# EAGLE design Yukari 3 9150 (EAGLE 6.2)
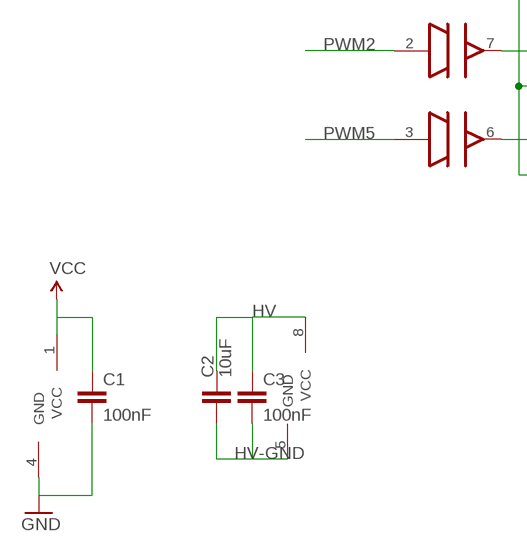
[diagram p0: schematic, sheet 1, part 1 of 2]
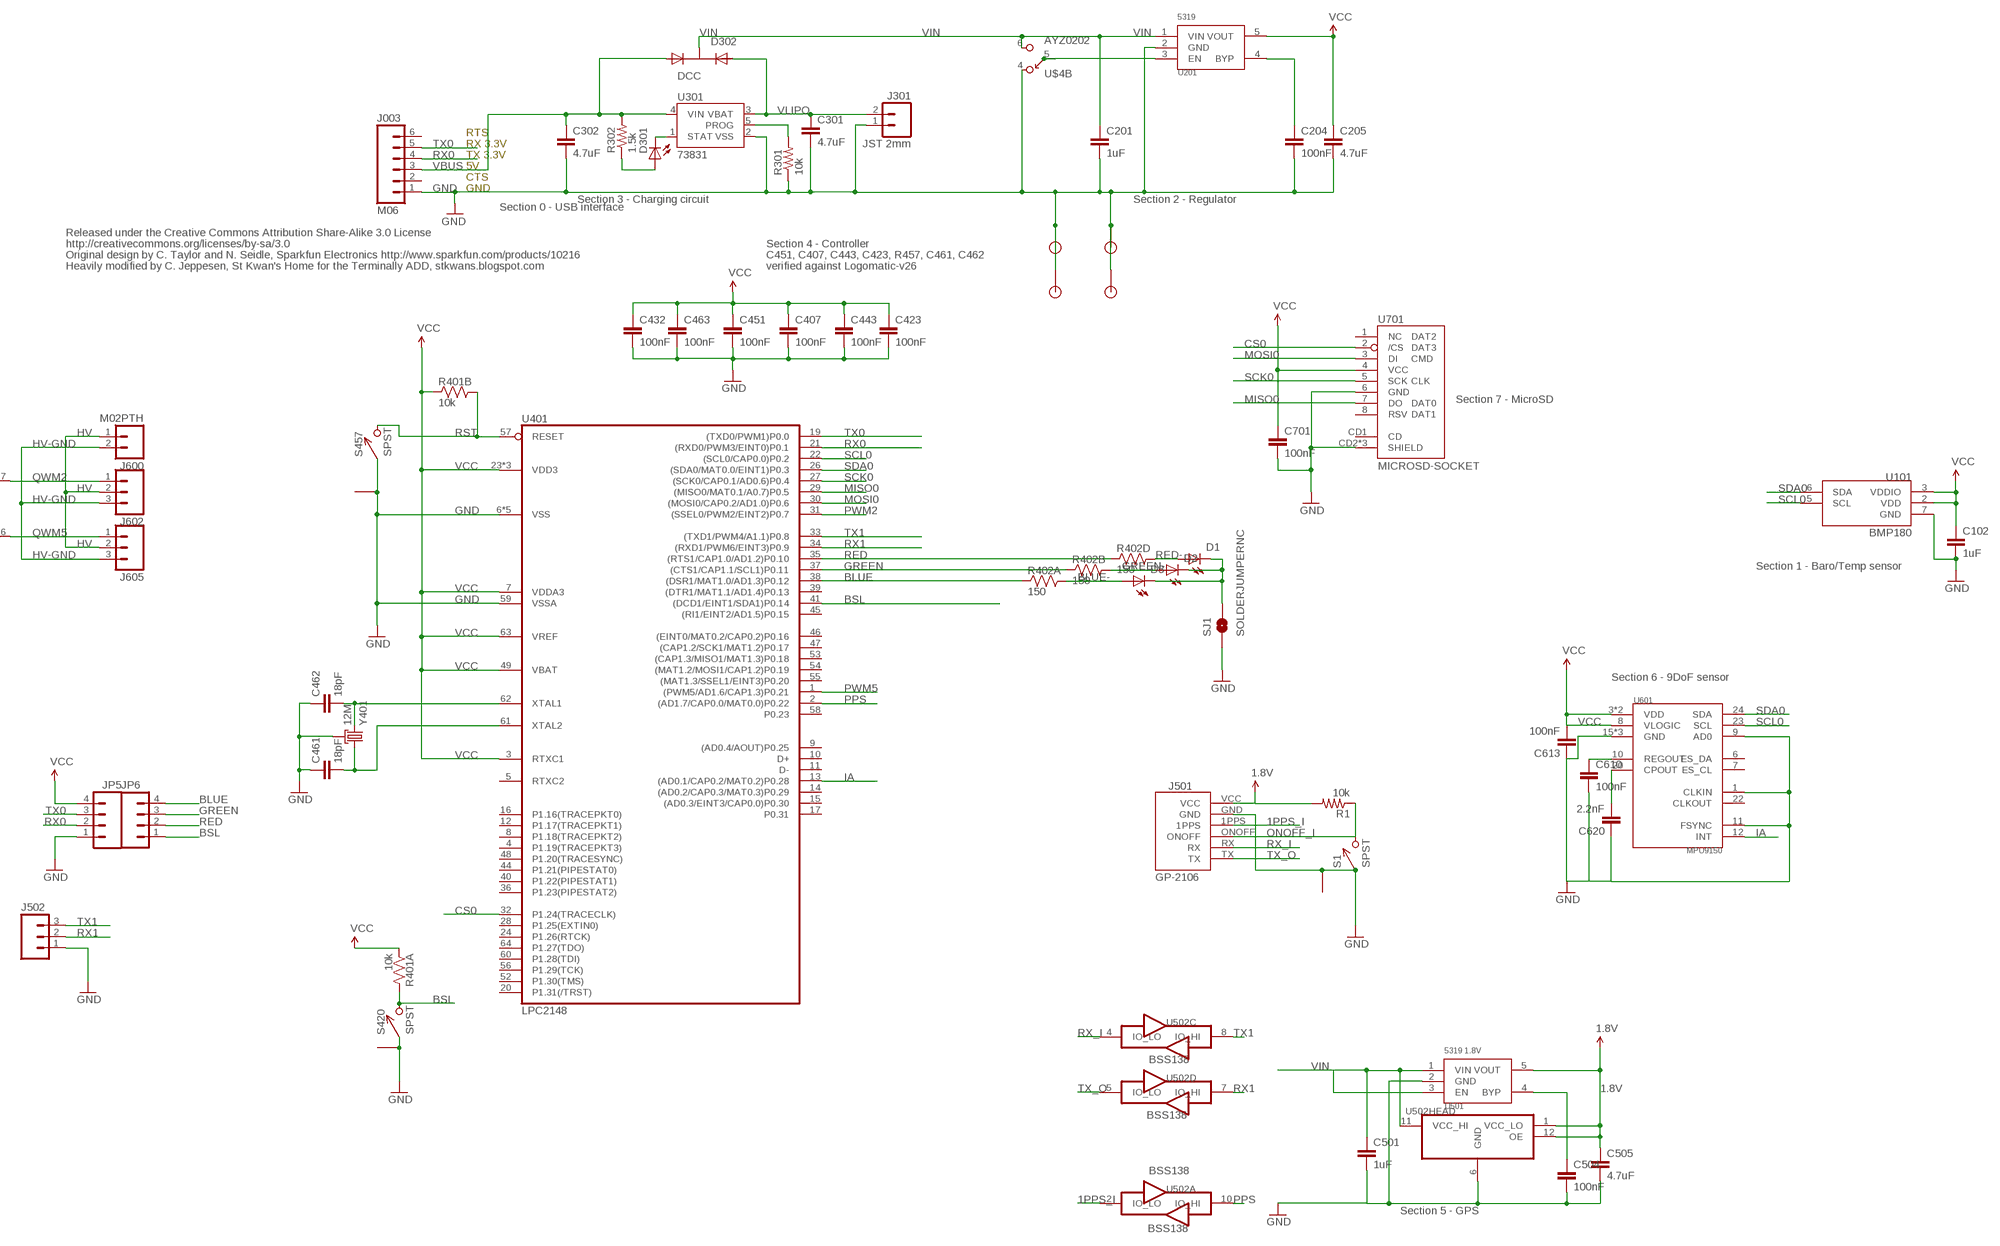
[diagram p1: schematic, sheet 1, part 2 of 2]

## Parts
C1  100nF  CAP0402-CAP  [0402-CAP]
C2  10uF  CAP0603-CAP  [0603-CAP]
C3  100nF  CAP0402-CAP  [0402-CAP]
C102  1uF  CAP0402-CAP  [0402-CAP]
C201  1uF  CAP0402-CAP  [0402-CAP]
C204  100nF  CAP0402-CAP  [0402-CAP]
C205  4.7uF  CAP0402-CAP  [0402-CAP]
C301  4.7uF  CAP0402-CAP  [0402-CAP]
C302  4.7uF  CAP0402-CAP  [0402-CAP]
C407  100nF  CAP0402-CAP  [0402-CAP]
C423  100nF  CAP0402-CAP  [0402-CAP]
C432  100nF  CAP0402-CAP  [0402-CAP]
C443  100nF  CAP0402-CAP  [0402-CAP]
C451  100nF  CAP0402-CAP  [0402-CAP]
C461  18pF  CAP0402-CAP  [0402-CAP]
C462  18pF  CAP0402-CAP  [0402-CAP]
C463  100nF  CAP0402-CAP  [0402-CAP]
C501  1uF  CAP0402-CAP  [0402-CAP]
C504  100nF  CAP0402-CAP  [0402-CAP]
C505  4.7uF  CAP0402-CAP  [0402-CAP]
C610  100nF  CAP0402-CAP  [0402-CAP]
C613  100nF  CAP0402-CAP  [0402-CAP]
C620  2.2nF  CAP0402-CAP  [0402-CAP]
C701  100nF  CAP0402-CAP  [0402-CAP]
D1  RED  LED0603  [LED-0603]
D2  GREEN  LED0603  [LED-0603]
D3  BLUE  LED0603  [LED-0603]
D301  RED  LED0603  [LED-0603]
D302  DCC  PMEG2005CT  [SOT-23-3]
J003  M06  M06SIP  [1X06]
J301  JST 2mm  M02-JST-2MM-SMT  [JST-2-SMD]
J501  GP-2106  [GP-2106]
J502  M03PTH  [1X03]
J600  M02PTH  [1X02]
J602  M03PTH  [1X03]
J605  M03PTH  [1X03]
JP1  STANDOFF  [STANDOFF]
JP2  STANDOFF  [STANDOFF]
JP3  STANDOFF  [STANDOFF]
JP4  STANDOFF  [STANDOFF]
JP5  M04PTH  [1X04]
JP6  M04PTH  [1X04]
R1  10k  RESISTOR0402-RES  [0402-RES]
R301  10k  RESISTOR0402-RES  [0402-RES]
R302  1.5k  RESISTOR0402-RES  [0402-RES]
R401  10k  RP2EXB24V  [CRA02]
R402  150  RP404  [CRA04]
S1  SPST  B3U-1100P  [B3U-1100P]
S420  SPST  B3U-1100P  [B3U-1100P]
S457  SPST  B3U-1100P  [B3U-1100P]
SJ1  SOLDERJUMPERNC  [SJ_2S]
U101  BMP180  [BMP180]
U201  5319  MIC5319D5  [SOT-23-5]
U301  73831  MCP73831  [SOT23-5]
U401  LPC2148  [LQFP64]
U501  5319 1.8V  MIC5319D5  [SOT-23-5]
U502  TXB0104RUT  [R-PUQFN-N12]
U600  ADUM3221  [SO8N]
U601  MPU9150  [LLGA24]
U701  MICROSD-SOCKET  [MICROSD-SOCKET-PP]
U$4  AYZ0202  [AYZ0202]
Y401  12M  TSX-3225  [CRYSTAL_SMD]

## Nets
1.8V: C505.1 J501.VCC R1.2 U501.5(VOUT) U502.1(HEAD:VCC_LO) U502.12(HEAD:OE)
1PPS_I: J501.1PPS U502.2(A:IO_LO)
BLUE: JP6.4 R402.1 U401.38((DSR1/MAT1.0/AD1.3)P0.12)
BLUE-: D3.A R402.8
BSL: JP6.1 R401.4 S420.P$2 U401.41((DCD1/EINT1/SDA1)P0.14)
CHG_PROG: R301.2 U301.5(PROG)
CS0: U401.32(P1.24(TRACECLK)) U701.2(/CS)
EN: U201.3(EN) U$4.5
GND: C1.2 C102.2 C201.2 C204.2 C205.2 C301.2 C302.2 C407.2 C423.2 C432.2 C443.2 C451.2 C461.1 C462.1 C463.2 C501.2 C504.2 C505.2 C610.2 C613.1 C620.1 C701.2 J003.1 J301.1 J501.GND J502.1 JP1.P$1 JP2.P$1 JP3.P$1 JP4.P$1 JP5.1 R301.1 S1.P$1 S1.P$3 S420.P$1 S420.P$3 S457.P$1 S457.P$3 SJ1.1 U101.7(GND) U201.2(GND) U301.2(VSS) U401.6(VSS) U401.18(VSS) U401.25(VSS) U401.42(VSS) U401.50(VSS) U401.59(VSSA) U501.2(GND) U502.6(HEAD:GND) U600.4(INP:GND) U601.1(CLKIN) U601.9(AD0) U601.11(FSYNC) U601.15(GND) U601.17(GND) U601.18(GND) U701.6(GND) U701.CD2(SHIELD) U701.GND1(SHIELD) U701.GND3(SHIELD) U$4.4 Y401.2(GND) Y401.4(GND)
GREEN: JP6.3 R402.2 U401.37((CTS1/CAP1.1/SCL1)P0.11)
GREEN-: D2.A R402.7
HV: C2.1 C3.1 J600.1 J602.2 J605.2 U600.8(OUTP:VCC)
HV-GND: C2.2 C3.2 J600.2 J602.3 J605.3 U600.5(OUTP:GND)
IA: U401.13((AD0.1/CAP0.2/MAT0.2)P0.28) U601.12(INT)
MISO0: U401.29((MISO0/MAT0.1/A0.7)P0.5) U701.7(DO)
MOSI0: U401.30((MOSI0/CAP0.2/AD1.0)P0.6) U701.3(DI)
N$1: D1.C D2.C D3.C SJ1.2
N$2: C610.1 U601.10(REGOUT)
N$3: C620.2 U601.20(CPOUT)
N$12: C504.1 U501.4(BYP)
N$17: C204.1 U201.4(BYP)
ONOFF_I: J501.ONOFF R1.1 S1.P$2
PPS: U401.2((AD1.7/CAP0.0/MAT0.0)P0.22) U502.10(A:IO_HI)
PWM2: U401.31((SSEL0/PWM2/EINT2)P0.7) U600.2(A:IN)
PWM5: U401.1((PWM5/AD1.6/CAP1.3)P0.21) U600.3(B:IN)
QWM2: J602.1 U600.7(A:OUT)
QWM5: J605.1 U600.6(B:OUT)
RED: JP6.2 R402.4 U401.35((RTS1/CAP1.0/AD1.2)P0.10)
RED-: D1.A R402.5
RST: R401.3 S457.P$2 U401.57(RESET)
RX0: J003.4 JP5.2 U401.21((RXD0/PWM3/EINT0)P0.1)
RX1: J502.2 U401.34((RXD1/PWM6/EINT3)P0.9) U502.7(D:IO_HI)
RX_I: J501.RX U502.4(C:IO_LO)
SCK0: U401.27((SCK0/CAP0.1/AD0.6)P0.4) U701.5(SCK)
SCL0: U101.5(SCL) U401.22((SCL0/CAP0.0)P0.2) U601.23(SCL)
SDA0: U101.6(SDA) U401.26((SDA0/MAT0.0/EINT1)P0.3) U601.24(SDA)
STAT+: D301.A R302.1
STAT-: D301.C U301.1(STAT)
TX0: J003.5 JP5.3 U401.19((TXD0/PWM1)P0.0)
TX1: J502.3 U401.33((TXD1/PWM4/A1.1)P0.8) U502.8(C:IO_HI)
TX_O: J501.TX U502.5(D:IO_LO)
VBUS [power]: C302.1 D302.1(A1) J003.3 R302.2 U301.4(VIN)
VCC: C1.1 C102.1 C205.1 C407.1 C423.1 C432.1 C443.1 C451.1 C463.1 C613.2 C701.1 JP5.4 R401.1 R401.2 U101.2(VDD) U101.3(VDDIO) U201.5(VOUT) U401.3(RTXC1) U401.7(VDDA3) U401.23(VDD3) U401.43(VDD3) U401.49(VBAT) U401.51(VDD3) U401.63(VREF) U600.1(INP:VCC) U601.3(VDD) U601.8(VLOGIC) U601.13(VDD) U701.4(VCC)
VIN: C201.1 C501.1 D302.3(K) U201.1(VIN) U501.1(VIN) U501.3(EN) U502.11(HEAD:VCC_HI) U$4.6
VLIPO [power]: C301.1 D302.2(A2) J301.2 U301.3(VBAT)
XTAL1: C462.2 U401.62(XTAL1) Y401.3
XTAL2: C461.2 U401.61(XTAL2) Y401.1
Unconnected: J003.2 J003.6 R402.3 R402.6 U401.4(P1.19(TRACEPKT3)) U401.5(RTXC2) U401.8(P1.18(TRACEPKT2)) U401.9((AD0.4/AOUT)P0.25) U401.10(D+) U401.11(D-) U401.12(P1.17(TRACEPKT1)) U401.14((AD0.2/CAP0.3/MAT0.3)P0.29) U401.15((AD0.3/EINT3/CAP0.0)P0.30) U401.16(P1.16(TRACEPKT0)) U401.17(P0.31) U401.20(P1.31(/TRST)) U401.24(P1.26(RTCK)) U401.28(P1.25(EXTIN0)) U401.36(P1.23(PIPESTAT2)) U401.39((DTR1/MAT1.1/AD1.4)P0.13) U401.40(P1.22(PIPESTAT1)) U401.44(P1.21(PIPESTAT0)) U401.45((RI1/EINT2/AD1.5)P0.15) U401.46((EINT0/MAT0.2/CAP0.2)P0.16) U401.47((CAP1.2/SCK1/MAT1.2)P0.17) U401.48(P1.20(TRACESYNC)) U401.52(P1.30(TMS)) U401.53((CAP1.3/MISO1/MAT1.3)P0.18) U401.54((MAT1.2/MOSI1/CAP1.2)P0.19) U401.55((MAT1.3/SSEL1/EINT3)P0.20) U401.56(P1.29(TCK)) U401.58(P0.23) U401.60(P1.28(TDI)) U401.64(P1.27(TDO)) U502.3(B:IO_LO) U502.9(B:IO_HI) U601.6(ES_DA) U601.7(ES_CL) U601.22(CLKOUT) U701.1(NC) U701.8(RSV) U701.CD1(CD) U$4.1 U$4.2 U$4.3

## Notes on the sheet
- RTS
- RX 3.3V
- TX 3.3V
- 5V
- CTS
- GND
- Section 0 - USB interface | Section 3 - Charging circuit | Section 2 - Regulator
- Released under the Creative Commons Attribution Share-Alike 3.0 License
- http://creativecommons.org/licenses/by-sa/3.0 | Section 4 - Controller
- Original design by C. Taylor and N. Seidle, Sparkfun Electronics http://www.sparkfun.com/products/10216 | C451, C407, C443, C423, R457, C461, C462
- Heavily modified by C. Jeppesen, St Kwan's Home for the Terminally ADD, stkwans.blogspot.com | verified against Logomatic-v26
- Section 7 - MicroSD
- Section 1 - Baro/Temp sensor
- Section 6 - 9DoF sensor
- BSS138
- BSS138
- BSS138
- Section 5 - GPS
- BSS138

## Library data of the parts
C1 C3 C201 C204 C205 C301 C302 C407 C423 C432 C443 C451 C461-C463 C701 = SparkFun:CAP: Capacitor Standard 0603 ceramic capacitor, and 0.1" leaded capacitor.
C2 = SparkFun:CAP: Capacitor Standard 0603 ceramic capacitor, and 0.1" leaded capacitor.; DIGIKEY: 445-7486-1-ND
C102 C610 C613 = SparkFun-Passives:CAP: Capacitor Standard 0603 ceramic capacitor, and 0.1" leaded capacitor.; DIGIKEY: 445-1317-2-ND
C501 = SparkFun:CAP: Capacitor Standard 0603 ceramic capacitor, and 0.1" leaded capacitor.; DIGIKEY: 445-4114-1-ND
C504 = SparkFun:CAP: Capacitor Standard 0603 ceramic capacitor, and 0.1" leaded capacitor.; DIGIKEY: 445-1265-1-ND
C505 = SparkFun:CAP: Capacitor Standard 0603 ceramic capacitor, and 0.1" leaded capacitor.; DIGIKEY: 445-7395-1-ND
C620 = SparkFun-Passives:CAP: Capacitor Standard 0603 ceramic capacitor, and 0.1" leaded capacitor.; DIGIKEY: 445-1309-2-ND
D1-D3 D301 = SparkFun:LED: LEDs Standard schematic elements and footprints for 5mm, 3mm, 1206, and 0603 sized LEDs. 5mm - Spark Fun Electronics SKU : COM-00529 (and others)
D302 = KwanSystems:PMEG2005CT
J003 = SparkFun:M06: Header 6 Standard 6-pin 0.1" header. Use with straight break away headers (SKU : PRT-00116), right angle break away headers (PRT-00553), swiss pins (PRT-00743), machine pins (PRT-00117), and female headers (PRT-00115). Molex polarized connector foot print use with SKU : PRT-08094 with associated crimp pins and housings. NOTES ON THE VARIANTS LOCK and LOCK_LONGPADS... This footprint was designed to help hold the alignment of a through-hole component (i.e. 6-pin header) while soldering it into place. You may notice that each hole has been shifted either up or down by 0.005 of an inch from it's more standard position (which is a perfectly straight line). This slight alteration caused the pins (the squares in the middle) to touch the edges of the holes. Because they are alternating, it causes a "brace" to hold the component in place. 0.005 has proven to be the perfect amount of "off-center" position when using our standard breakaway headers. Although looks a little odd when you look at the bare footprint, once you have a header in there, the alteration is very hard to notice. Also, if you push a header all the way into place, it is covered up entirely on the bottom side. This idea of altering the position of holes to aid alignment will be further integrated into the Sparkfun Library for other footprints. It can help hold any component with 3 or more connection pins.
J301 = SparkFun:M02: Header 2 Standard 2-pin 0.1" header. Use with straight break away headers (SKU : PRT-00116), right angle break away headers (PRT-00553), swiss pins (PRT-00743), machine pins (PRT-00117), and female headers (PRT-00115). Molex polarized connector foot print use with SKU : PRT-08233 with associated crimp pins and housings.
J501 = SparkFun:GP-2106: GP-2106 GPS SiRF IV
J502 J602 J605 = SparkFun-Connectors:M03: Header 3 Standard 3-pin 0.1" header. Use with straight break away headers (SKU : PRT-00116), right angle break away headers (PRT-00553), swiss pins (PRT-00743), machine pins (PRT-00117), and female headers (PRT-00115). Molex polarized connector foot print use with SKU : PRT-08232 with associated crimp pins and housings.
J600 = SparkFun-Connectors:M02: Standard 2-pin 0.1" header. Use with - straight break away headers ( PRT-00116) - right angle break away headers (PRT-00553) - swiss pins (PRT-00743) - machine pins (PRT-00117) - female headers (PRT-00115) Molex polarized connector foot print use with: PRT-08233 with associated crimp pins and housings. 2.54_SCREWTERM for use with PRT-10571. 3.5mm Screw Terminal footprints for PRT-08084 5mm Screw Terminal footprints for use with PRT-08433
JP1-JP4 = KwanSystems:STANDOFF
JP5 JP6 = SparkFun-Connectors:M04: Header 4 Standard 4-pin 0.1" header. Use with straight break away headers (SKU : PRT-00116), right angle break away headers (PRT-00553), swiss pins (PRT-00743), machine pins (PRT-00117), and female headers (PRT-00115). Molex polarized connector foot print use with SKU : PRT-08231 with associated crimp pins and housings. 1MM SMD Version SKU: PRT-10208
R1 R301 R302 = SparkFun:RESISTOR: Resistor Basic schematic elements and footprints for 0603, 1206, and PTH resistors.
R401 = KwanSystems:RP2
R402 = KwanSystems:RP4
S1 S420 S457 = KwanSystems:B3U-1100P
SJ1 = SparkFun-Passives:SOLDERJUMPER: Solder Jumper Standard SMD solder jumper. Used to automate production. Two varients : Normally Open and Normally Closed are the same, but have different paste layers. NC will have a large amount of paste and should jumper during reflow.
U101 = KwanSystems:BMP180; DIGIKEY: 828-1027-1-ND
U201 = KwanSystems:MIC5319
U301 = SparkFun:MCP73831: Microchip's MCP73831 Miniature single cell, fully integrated Li-Ion, Li-polymer charge management controller http://ww1.microchip.com/downloads/en/DeviceDoc/21984a.pdf
U401 = KwanSystems:LPC2148
U501 = KwanSystems:MIC5319; DIGIKEY: 576-1910-1-ND
U502 = KwanSystems:TXB0104
U600 = KwanSystems:ADUM3221
U601 = KwanSystems:MPU9150
U701 = KwanSystems:MICROSD-SOCKET: microSD Socket Push-push type uSD socket. Digikey 101-00660-68-6-1-ND. tDoc lines correctly indicate media card edge positions when inserting (unlocked, locked, depressed).
U$4 = KwanSystems:AYZ0202
Y401 = KwanSystems:TSX-3225

## Net classes
0 default: width 0.152 mm, drill 0.33 mm, clearance 0.152 mm
1 power: width 0.152 mm, drill 0.33 mm, clearance 0.152 mm
2 hp: width 0.508 mm, drill 0.33 mm, clearance 0.508 mm

## Board
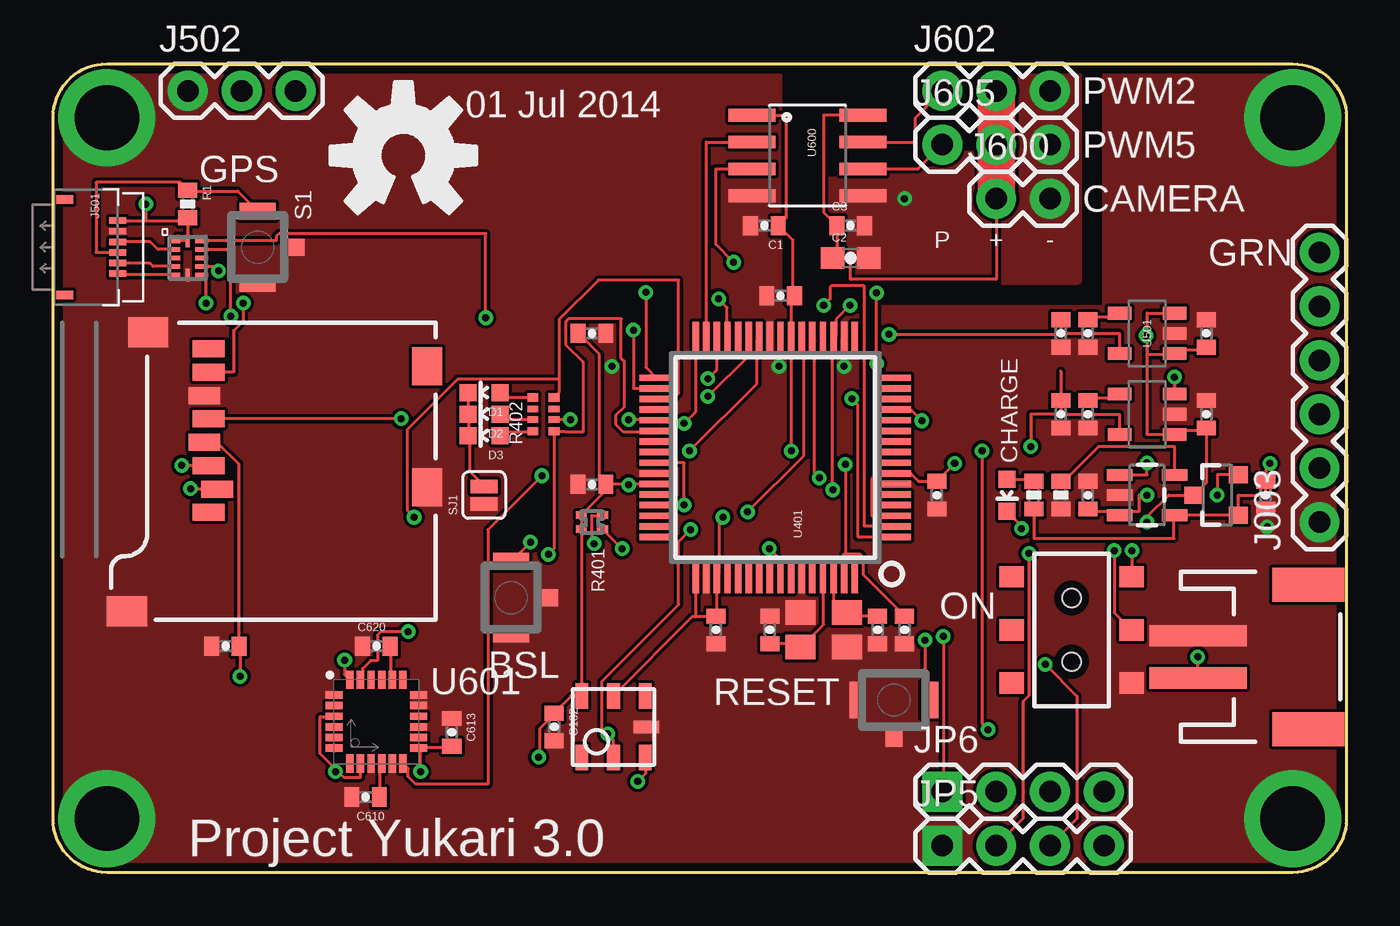
[diagram p2: board, top side]
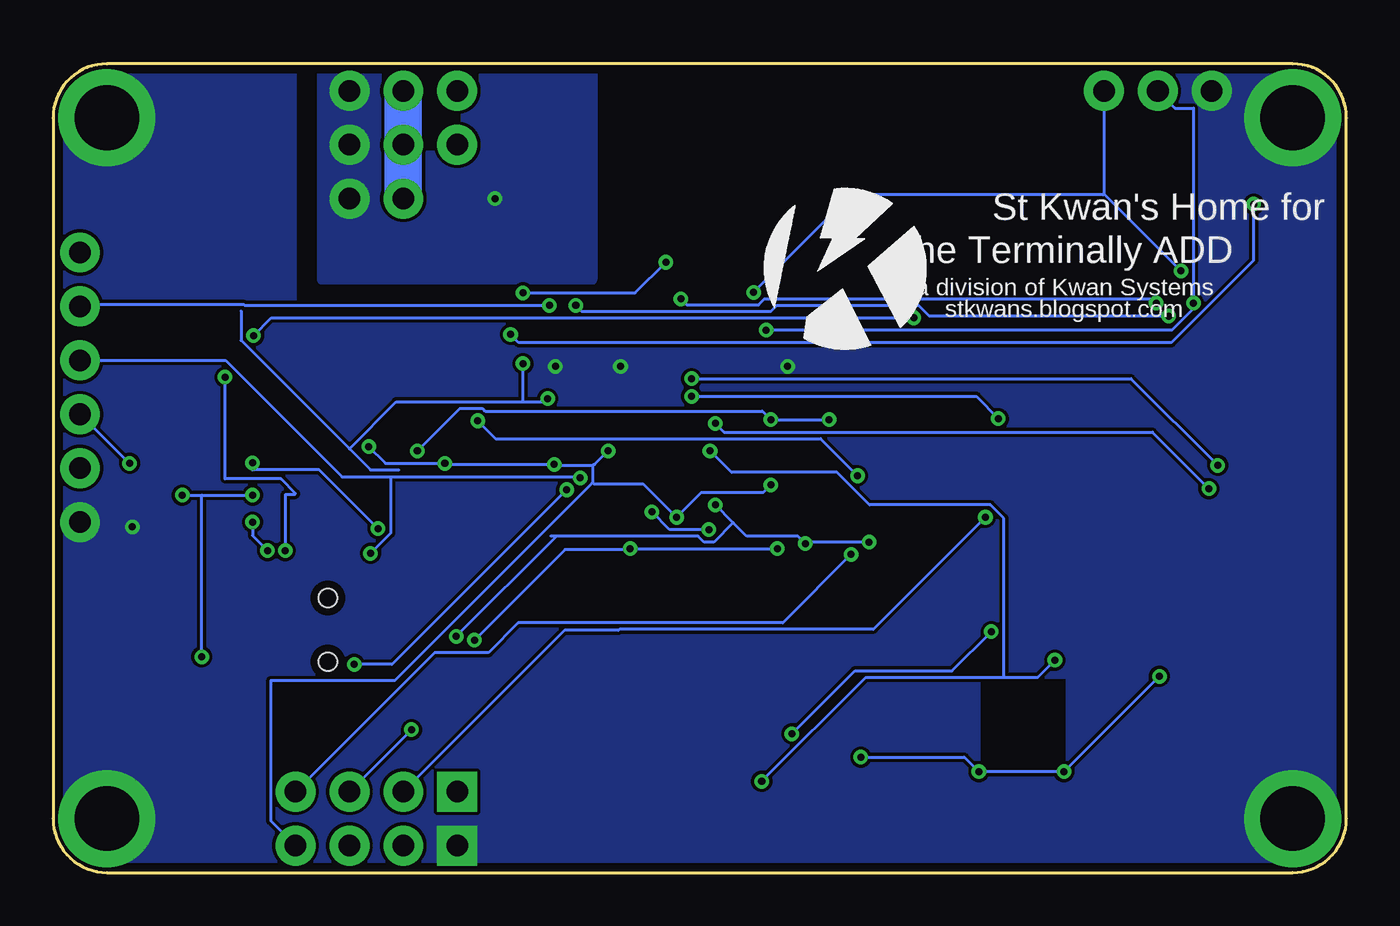
[diagram p3: board, bottom side, seen from below]

Size 60.96 x 38.1 mm. Coordinates in mm from the lower left corner, seen from the top.
Outline: 2.54,38.1 58.42,38.1 arc-90 60.96,35.56 60.96,2.54 arc-90 58.42,0 2.54,0 arc-90 0,2.54 0,35.56 arc-90 2.54,38.1
Copper layers (1*16): Top 0.0356mm / dielectric 1.5011mm / Bottom 0.0356mm
Design rules: minimum track width 6mil, minimum drill 13mil, track to track 6mil, track to pad 6mil, pad to pad 6mil, via to via 6mil, smd to smd 6mil, copper to edge 15mil, drill to drill 6mil, minimum pad ring 7mil, minimum via ring 7mil, stop-mask expansion 4mil, vias tented up to drill 14mil, thermal gap 10mil
vRestrict: area 0.3,28.7 to 19.6,31.5; area 1.5,27.2 to 19.6,27.9; area 41.9,11.9 to 43.9,13.2; area 20.1,25.1 to 27.2,32.3

### Footprints (pad centres in the part's own frame; a part is rotated, then mirrored left to right if it is on the bottom)
0402-CAP = smd 0.7 x 0.9: 1 -0.65,0; 2 0.65,0
0603-CAP = smd 1.1 x 1: 1 -0.85,0; 2 0.85,0
LED-0603 = smd 0.8 x 0.8: A 0,-0.75; C 0,0.75
SOT-23-3 = smd 0.9 x 0.8: 1 -1,0.95; 2 -1,-0.95; 3 1.1,0
1X06 = drill 1.016 pad 1.88: 1 0,0; 2 2.54,0; 3 5.08,0; 4 7.62,0; 5 10.16,0; 6 12.7,0
JST-2-SMD = smd 1 x 4.6: 1 -1,-3.7; 2 1,-3.7 | smd 1.6 x 3.4: NC1 -3.4,1.5; NC2 3.4,1.5
GP-2106 = smd 0.3 x 0.8: 1PPS -0.25,0; GND -0.75,0; ONOFF 0.25,0; RX 0.75,0; TX 1.25,0; VCC -1.25,0 | smd 0.4 x 0.8: P$7 -2.25,-2.5; P$8 2.25,-2.5
1X03 = drill 1.016 pad 1.88: 1 0,0; 2 2.54,0; 3 5.08,0
1X02 = drill 1.016 pad 1.88: 1 0,0; 2 2.54,0
STANDOFF = drill 3.048 pad 4.572: P$1 0,0
1X04 = drill 1.016 pad 1.88 square: 1 0,0 | drill 1.016 pad 1.88: 2 2.54,0; 3 5.08,0; 4 7.62,0
0402-RES = smd 0.7 x 0.9: 1 -0.65,0; 2 0.65,0
CRA02 = smd 0.35 x 0.5: 1 -0.325,-0.5; 2 0.325,-0.5; 3 0.325,0.5; 4 -0.325,0.5
CRA04 = smd 0.4 x 0.5: 1 -0.8,-0.5; 4 0.8,-0.5; 5 0.8,0.5; 8 -0.8,0.5 | smd 0.3 x 0.5: 2 -0.25,-0.5; 3 0.25,-0.5; 6 0.25,0.5; 7 -0.25,0.5
B3U-1100P = smd 0.8 x 1.7: P$1 -1.7,0; P$2 1.7,0 | smd 0.8 x 1.1: P$3 0,-1.65
SJ_2S = smd 0.635 x 1.27: 1 -0.412,0; 2 0.412,0
BMP180 = smd 0.6 x 1.2: 1 1.5,1.45; 2 0,1.45; 3 -1.5,1.45; 4 -1.5,-1.45; 5 0,-1.45; 6 1.5,-1.45 | smd 1.2 x 0.6: 7 1.55,0
SOT-23-5 = smd 0.6 x 1.1: 1 -0.95,-1.3; 2 0,-1.3; 3 0.95,-1.3; 4 0.95,1.3; 5 -0.95,1.3
SOT23-5 = smd 0.55 x 1.2: 1 -0.95,-1.3; 2 0,-1.3; 3 0.95,-1.3; 4 0.95,1.3; 5 -0.95,1.3
LQFP64 = smd 0.3 x 1.6: 1 -3.75,-5.6; 2 -3.25,-5.6; 3 -2.75,-5.6; 4 -2.25,-5.6; 5 -1.75,-5.6; 6 -1.25,-5.6; 7 -0.75,-5.6; 8 -0.25,-5.6; 9 0.25,-5.6; 10 0.75,-5.6; 11 1.25,-5.6; 12 1.75,-5.6; 13 2.25,-5.6; 14 2.75,-5.6; 15 3.25,-5.6; 16 3.75,-5.6; 33 3.75,5.6; 34 3.25,5.6; 35 2.75,5.6; 36 2.25,5.6; 37 1.75,5.6; 38 1.25,5.6; 39 0.75,5.6; 40 0.25,5.6; 41 -0.25,5.6; 42 -0.75,5.6; 43 -1.25,5.6; 44 -1.75,5.6; 45 -2.25,5.6; 46 -2.75,5.6; 47 -3.25,5.6; 48 -3.75,5.6 | smd 1.6 x 0.3: 17 5.6,-3.75; 18 5.6,-3.25; 19 5.6,-2.75; 20 5.6,-2.25; 21 5.6,-1.75; 22 5.6,-1.25; 23 5.6,-0.75; 24 5.6,-0.25; 25 5.6,0.25; 26 5.6,0.75; 27 5.6,1.25; 28 5.6,1.75; 29 5.6,2.25; 30 5.6,2.75; 31 5.6,3.25; 32 5.6,3.75; 49 -5.6,3.75; 50 -5.6,3.25; 51 -5.6,2.75; 52 -5.6,2.25; 53 -5.6,1.75; 54 -5.6,1.25; 55 -5.6,0.75; 56 -5.6,0.25; 57 -5.6,-0.25; 58 -5.6,-0.75; 59 -5.6,-1.25; 60 -5.6,-1.75; 61 -5.6,-2.25; 62 -5.6,-2.75; 63 -5.6,-3.25; 64 -5.6,-3.75
R-PUQFN-N12 = smd 0.2 x 0.6: 1 -0.8,-0.65; 2 -0.4,-0.65; 3 0,-0.65; 4 0.4,-0.65; 5 0.8,-0.65; 7 0.8,0.65; 8 0.4,0.65; 9 0,0.65; 10 -0.4,0.65; 11 -0.8,0.65 | smd 0.6 x 0.2: 6 0.8,0; 12 -0.8,0
SO8N = smd 0.61 x 2.21: 1 -1.905,-2.616; 2 -0.635,-2.616; 3 0.635,-2.616; 4 1.905,-2.616; 5 1.905,2.616; 6 0.635,2.616; 7 -0.635,2.616; 8 -1.905,2.616
LLGA24 = smd 0.8 x 0.35: 1 -2,1.25; 2 -2,0.75; 3 -2,0.25; 4 -2,-0.25; 5 -2,-0.75; 6 -2,-1.25; 13 2,-1.25; 14 2,-0.75; 15 2,-0.25; 16 2,0.25; 17 2,0.75; 18 2,1.25 | smd 0.35 x 0.85: 7 -1.25,-1.975; 8 -0.75,-1.975; 9 -0.25,-1.975; 10 0.25,-1.975; 11 0.75,-1.975; 12 1.25,-1.975; 19 1.25,1.975; 20 0.75,1.975; 21 0.25,1.975; 22 -0.25,1.975; 23 -0.75,1.975; 24 -1.25,1.975
MICROSD-SOCKET-PP = smd 0.8 x 1.5: 1 -8.94,10.7; 2 -7.84,10.3; 3 -6.74,10.7; 4 -5.64,10.9; 5 -4.54,10.7; 6 -3.44,10.9; 7 -2.34,10.7; 8 -1.24,10.7 | smd 1.8 x 1.4: CD1 -2.05,0.4; CD2 -7.75,0.4 | smd 1.4 x 1.9: GND1 -13.6,14.55; GND3 -0.45,13.55
AYZ0202 = smd 1 x 1.15: 1 -2.5,2.825; 2 0,2.825; 3 2.5,2.825; 4 -2.5,-2.825; 5 0,-2.825; 6 2.5,-2.825 | hole 0.85: 1.5,0; -1.5,0
CRYSTAL_SMD = smd 1.4 x 1.15: 1 -1.092,-0.813; 2 1.092,-0.813; 3 1.092,0.813; 4 -1.092,0.813

### Placement (x,y rotation side)
C1  33.53,30.48 180 top
C2  37.59,28.96 0 top
C3  37.59,30.48 0 top
C102  23.62,6.86 270 top
C201  54.36,21.59 90 top
C204  48.77,21.59 270 top
C205  47.5,21.59 270 top
C301  48.77,17.78 90 top
C302  57.15,17.78 270 top
C407  41.66,17.78 270 top
C423  34.29,27.18 180 top
C432  25.4,25.4 0 top
C443  25.4,18.29 180 top
C451  31.24,11.43 270 top
C461  33.78,11.43 270 top
C462  38.86,11.43 90 top
C463  40.13,11.43 270 top
C501  54.36,25.4 90 top
C504  48.77,25.4 270 top
C505  47.5,25.4 270 top
C610  14.73,3.56 180 top
C613  18.8,6.6 270 top
C620  15.24,10.67 0 top
C701  8.13,10.67 180 top
D1  20.32,22.61 90 top
D2  20.32,21.59 90 top
D3  20.32,20.57 90 top
D301  44.96,17.78 180 top
D302  54.86,17.78 180 top
J003  59.69,16.51 90 top
J301  57.66,10.16 270 top
J501  3.05,29.46 270 top
J502  6.35,36.83 0 top
J600  44.45,31.75 0 top
J602  41.91,36.83 0 top
J605  41.91,34.29 0 top
JP1  2.54,2.54 0 top
JP2  58.42,2.54 0 top
JP3  2.54,35.56 0 top
JP4  58.42,35.56 0 top
JP5  41.91,1.27 0 top
JP6  41.91,3.81 0 top
R1  6.35,31.5 270 top
R301  47.5,17.78 90 top
R302  46.23,17.78 270 top
R401  25.4,16.51 270 top
R402  23.11,21.59 90 top
S1  9.65,29.46 90 top
S420  21.59,12.95 90 top
S457  39.62,8.13 0 top
SJ1  20.32,17.78 90 top
U101  26.42,6.86 0 top
U201  51.56,21.59 90 top
U301  51.56,17.78 270 top
U401  34.04,19.56 90 top
U501  51.56,25.4 90 top
U502  6.35,28.96 270 top
U600  35.56,33.78 270 top
U601  15.24,7.11 0 top
U701  18.03,25.91 90 top
U$1  [KWAN_CIRCLE]  23.62,28.45 0 bottom
U$2  [OSHW-LOGO-L]  16.51,33.78 0 top
U$4  48.01,11.43 90 top
Y401  36.32,11.43 0 top

### Tracks (layer width: path | path; a pad name or v marks a point on that pad's centre or on a via)
1.8V  (via drill 0.33)
  Top 0.152: 47.5,25.4 C505.1 47.45,25.88 | 47.5,25.4 50.26,25.4 U501.5 | U502.1 5.71,29.77 U502.12 R1.2 | 3.05,30.73 J501.VCC 4.37,30.71 | R1.2 6.3,30.89 6.25,30.89 | v39.4,25.35 47.45,25.35 47.5,25.4 | 4.37,30.71 6.22,30.71 R1.2 | v4.37,31.5 4.37,30.71
  Bottom 0.152: v39.4,25.35 39.01,24.97 8.26,24.97 4.37,28.85 v4.37,31.5
1PPS_I
  Top 0.152: U502.2 4.93,29.36 4.57,29.72 J501.1PPS
BLUE  (via drill 0.33)
  Top 0.152: U401.38 28.42,20.8 28.42,20.75 26.9,20.75 26.54,21.11 26.54,21.57 26.92,21.95 26.92,24.08 26.77,24.23 26.77,26.09 24.31,26.09 24.16,25.93 24.16,24.87 24.97,24.05 24.97,20.75 24.16,20.75 24.13,20.78 23.62,20.78 R402.1 23.62,20.7 23.62,15.27 v23.34,14.99
  Bottom 0.152: v23.34,14.99 26.57,11.76 39.04,11.76 40.44,10.36 42.98,10.36 JP6.4
BLUE-
  Top 0.152: R402.8 22.61,20.78 21.08,20.78 21.08,20.57 D3.A
BSL  (via drill 0.33)
  Top 0.152: v25.5,15.49 25.4,15.6 25.4,16.82 25.88,16.82 R401.4 | v22.5,15.57 S420.P$2 | v29.74,17.32 29.74,19.3 U401.41 | JP6.1 41.96,3.86 v41.96,11.12
  Bottom 0.152: v22.5,15.57 25.43,15.57 v25.5,15.49 25.86,15.85 28.27,15.85 28.91,16.48 | 28.91,16.48 v29.74,17.32 | 37.29,15.85 30.56,15.85 30.28,15.57 29.82,15.57 28.91,16.48 | 37.29,15.85 37.49,15.85 | v41.96,11.12 37.29,15.8 37.29,15.85
CHG_PROG
  Top 0.152: 52.86,18.75 U301.5 52.86,20.07 49.28,20.07 47.64,18.43 R301.2
CS0  (via drill 0.33)
  Top 0.152: v6.48,18.09 7.72,18.09 U701.2 | v29.74,21.16 30.28,21.69 30.28,25.15 U401.32
  Bottom 0.152: v6.48,18.09 9.14,20.75 29.34,20.75 v29.74,21.16
EN  (via drill 0.33)
  Top 0.152: v52.86,23.34 52.86,22.55 U201.3 | v50.01,15.16 50.01,12.24 U$4.5
  Bottom 0.152: v52.86,23.34 52.86,18.54 50.22,18.54 49.53,17.86 49.58,17.8 50.01,17.8 v50.01,15.16
GND  (via drill 0.33)
  other vias: 57.23,16.28 37.29,23.85 34.21,23.85 26.34,23.85
  pour Top (no thermals): 2.54,38.1 34.29,38.1 34.29,26.67 49.53,26.67 49.53,38.1 58.42,38.1 arc-90 60.96,35.56 60.96,2.54 arc-90 58.42,0 2.54,0 arc-90 0,2.54 0,35.56 arc-90
  pour Bottom (no thermals): 2.54,38.1 34.29,38.1 34.29,26.67 49.53,26.67 49.53,38.1 58.42,38.1 arc-90 60.96,35.56 60.96,2.54 arc-90 58.42,0 2.54,0 arc-90 0,2.54 0,35.56 arc-90
GREEN  (via drill 0.33)
  Top 0.152: v24.38,21.34 23.62,21.34 R402.2 | v27.13,21.34 28.42,21.34 28.42,21.31 U401.37 | v43.79,19.86 43.79,7.01 v44.07,6.73
  Bottom 0.152: v24.38,21.34 v27.13,21.34 27.53,21.74 40.59,21.74 40.72,21.87 41.78,21.87 v43.79,19.86 | v44.07,6.73 JP6.3
GREEN-
  Top 0.152: R402.7 22.61,21.36 21.08,21.36 21.08,21.59 D2.A
HV
  Top 0.152: U600.8 36.32,35.69 36.32,31.1 C3.1 36.94,29.16 C2.1 37.59,28.96 37.59,27.94 44.45,27.94 J600.1
  Top 1.778: J602.2 J605.2 J600.1
  Bottom 1.778: J600.1 J605.2 44.45,36.58
HV-GND  (via drill 0.33)
  other vias: 40.13,31.75
  pour Bottom (no thermals): 35.56,38.1 35.56,27.94 48.26,27.94 48.26,38.1
  pour Top (no thermals): 35.56,38.1 35.56,27.94 48.26,27.94 48.26,38.1
IA  (via drill 0.33)
  Top 0.152: v23.04,18.69 20.5,16.15 20.5,4.17 17.09,4.17 16.74,4.52 16.74,4.9 16.51,5.13 U601.12 | v40.95,21.29 40.44,21.79 39.65,21.79 U401.13
  Bottom 0.152: v23.04,18.69 24.79,20.45 40.11,20.45 v40.95,21.29
MISO0  (via drill 0.33)
  Top 0.152: v8.97,26.82 8.97,25.98 8.51,25.53 8.51,23.57 U701.7 | v31.37,27.03 31.77,26.62 31.77,25.17 U401.29
  Bottom 0.152: v8.97,26.82 9.17,27.03 27.43,27.03 27.71,26.75 31.09,26.75 v31.37,27.03
MOSI0  (via drill 0.33)
  Top 0.152: v6.07,19.18 7.32,19.18 U701.3 | v30.86,23.27 31.27,23.67 31.27,25.15 U401.30
  Bottom 0.152: v6.07,19.18 10.16,23.27 v30.86,23.27
N$1
  Top 0.152: D1.C 19.58,22.61 19.58,21.64 D2.C 19.58,21.59 19.58,20.57 D3.C 19.63,20.52 19.63,18.9 20.32,18.21 SJ1.2
N$2
  Top 0.152: U601.10 15.47,5.13 15.42,5.08 15.42,3.58 15.39,3.56 C610.1
N$3
  Top 0.152: U601.20 15.98,9.09 15.9,9.17 C620.2
N$12
  Top 0.152: U501.4 50.07,26.16 48.88,26.16 arc90 C504.1
N$17
  Top 0.152: U201.4 50.23,22.54 arc90 50.04,22.35 48.88,22.35 arc90 C204.1
ONOFF_I
  Top 0.152: 6.4,32.11 8.71,32.11 S1.P$2 | 6.4,32.11 R1.1 | 6.4,32.11 5.99,32.51 2.03,32.51 2.03,29.21 J501.ONOFF
PPS  (via drill 0.33)
  Top 0.152: v8.38,26.21 8.38,29.34 7.01,29.34 U502.10 | v36.32,26.72 36.63,27.03 36.63,27.58 36.68,27.64 38.23,27.64 38.23,16.33 39.62,16.33 U401.2
  Bottom 0.152: v8.38,26.21 8.41,26.24 19.68,26.24 20.17,26.72 26.85,26.72 27.13,26.44 36.04,26.44 v36.32,26.72
PWM2
  Top 0.152: 32.46,34.42 U600.2 30.79,34.42 U401.31
PWM5  (via drill 0.33)
  Top 0.152: v37.64,22.33 37.92,22.05 37.92,15.82 39.62,15.82 U401.1 | v38.81,23.98 v38.81,27.3 | v32.08,28.75 31.24,29.59 31.24,33.15 U600.3
  Bottom 0.152: 44.65,18.97 46,18.97 46.99,19.96 | 46.99,19.96 52.09,25.07 52.09,26.47 | v37.64,22.33 37.8,22.17 38.81,22.17 | 38.81,22.17 44.78,22.17 46.99,19.96 | v38.81,27.3 33.53,27.3 v32.08,28.75 | 38.81,22.17 v38.81,23.98
QWM2
  Top 0.152: U600.7 40.64,34.42 40.64,35.56 J602.1
QWM5
  Top 0.152: U600.6 40.77,33.15 J605.1
RED  (via drill 0.33)
  Top 0.152: 23.85,23.24 23.85,26.06 25.7,27.91 29.49,27.91 29.49,22.58 29.23,22.33 28.45,22.33 U401.35 | 23.85,23.24 23.85,22.63 23.62,22.4 R402.4 | v17.02,16.74 16.69,17.07 16.69,20.85 19.07,23.24 23.85,23.24
  Bottom 0.152: v17.02,16.74 22.3,11.46 34.27,11.46 34.31,11.4 36.85,11.4 JP6.2
RED-
  Top 0.152: R402.5 22.61,22.4 21.08,22.4 21.08,22.61 D1.A
RST  (via drill 0.33)
  Top 0.152: v26.82,15.27 R401.3 | v33.76,15.27 34.27,14.76 34.27,13.97 U401.57 | v41.1,10.95 41.1,8.33 41.3,8.13 S457.P$2
  Bottom 0.152: v26.82,15.27 v33.76,15.27 33.81,15.21 36.83,15.21 v41.1,10.95
RX0  (via drill 0.33)
  Top 0.152: v36.12,18.59 35.89,18.82 35.89,25.04 35.79,25.15 U401.21 | v46,15.04 46,8.33 45.72,8.05 45.72,2.54 JP5.2
  Bottom 0.152: v36.12,18.59 36.17,18.64 45.06,18.64 | 45.06,18.64 47.35,18.64 52.83,24.13 J003.4 | v46,15.04 45.06,15.98 45.06,18.64
RX1  (via drill 0.33)
  Top 0.152: v7.21,26.82 7.21,27.94 7.01,28.14 U502.7 | v27.36,25.55 27.36,22.81 28.42,22.81 U401.34
  Bottom 0.152: J502.2 8.08,36.02 7.21,36.02 v7.21,26.82 7.26,26.77 7.26,26.52 8.23,25.55 v27.36,25.55
RX_I
  Top 0.152: U502.4 4.72,28.56 4.57,28.7 J501.RX
SCK0  (via drill 0.33)
  Top 0.152: v16.41,21.39 7.34,21.39 U701.5 | v30.86,22.43 32.77,24.33 32.77,25.15 U401.27
  Bottom 0.152: v16.41,21.39 17.45,22.43 v30.86,22.43
SCL0  (via drill 0.33)
  Top 0.152: v16.74,11.35 15.44,11.35 15.29,11.2 15.29,9.98 14.96,9.98 14.58,9.6 14.58,9.17 14.5,9.09 U601.23 | U101.5 26.42,6.25 v26.14,6.53 25.88,6.78 25.88,9.02 29.49,12.62 29.49,15.6 v30.05,16.15 | v32.74,16.99 35.38,19.63 35.38,25.07 35.31,25.15 U401.22
  Bottom 0.152: v16.74,11.35 18.59,9.5 23.16,9.5 v26.14,6.53 | v32.74,16.99 31.9,16.15 v30.05,16.15
SDA0  (via drill 0.33)
  Top 0.152: v13.74,10.01 13.74,9.32 13.97,9.09 U601.24 | v27.56,4.29 27.91,4.65 27.91,5.38 U101.6 | U401.26 33.17,25.04 33.17,23.04 v30,19.86
  Bottom 0.152: v13.74,10.01 14.55,9.2 16.15,9.2 | 16.15,9.2 22.66,9.2 v27.56,4.29 | v30,19.86 28.98,18.85 24,18.85 22.48,17.32 16.79,17.32 16.15,16.69 16.15,9.2
STAT+
  Top 0.152: D301.A 46.13,18.53 arc-90 R302.1
STAT-  (via drill 0.33)
  Top 0.152: v45.64,16.2 45.64,16.33 44.96,17.02 D301.C | 50.24,18.75 U301.1 51.56,18.73 v51.56,19.3
  Bottom 0.152: v45.64,16.2 48.41,18.97 51.56,18.97 v51.56,19.3
TX0  (via drill 0.33)
  Top 0.152: v37.57,26.72 36.91,26.06 36.91,25.27 36.8,25.17 U401.19 36.75,25.09 36.7,25.04 36.7,18.09 v36.75,18.03 | v46.76,9.8 48.26,8.31 48.26,2.54 JP5.3
  Bottom 0.152: v37.57,26.72 51.92,26.72 51.97,26.77 59.59,26.77 J003.5 | v36.75,18.03 44.98,9.8 v46.76,9.8
TX1  (via drill 0.33)
  Top 0.152: v7.8,28.35 7.8,28.55 U502.8 | v27.94,27.33 27.94,23.8 28.42,23.32 U401.33
  Bottom 0.152: 11.43,31.98 v7.8,28.35 | J502.3 11.43,31.98 | v27.94,27.33 23.34,31.93 11.48,31.93 11.43,31.98
TX_O
  Top 0.152: U502.5 3.11,28.16 J501.TX
VBUS  (via drill 0.33)
  Top 0.152: R302.2 46.23,15.75 52.83,15.75 52.83,16.83 U301.4 D302.1 55.86,17.78 57.15,17.78 C302.1 57.17,18.49 57.17,19.1 v57.35,19.28
  Bottom 0.152: J003.3 57.38,19.28 v57.35,19.28
VCC  (via drill 0.33)
  Top 0.152: 47.5,21.59 C205.1 47.5,23.62 | 47.5,21.59 50.26,21.59 U201.5 50.19,20.62 | 47.5,21.59 46.08,21.59 v46.08,20.07 | C613.2 18.8,5.87 U601.13 17.27,5.79 17.32,5.74 v17.32,4.75 | 13.36,4.83 13.72,4.47 14.48,4.47 14.48,5.13 U601.8 | 13.36,4.83 12.6,5.59 12.6,7.34 13.23,7.34 U601.3 | v13.31,4.75 13.31,4.78 13.36,4.83 | U701.4 7.14,20.24 7.75,20.24 8.74,19.25 8.74,10.69 8.76,10.67 C701.1 8.81,10.62 v8.81,9.25 | C443.1 26.04,18.29 26.04,17.98 24.94,16.89 R401.1 24.92,16.82 24.92,16.2 R401.2 24.92,16.13 24.92,8.38 U101.3 24.89,8.31 24.41,8.31 C102.1 23.6,7.44 22.94,6.78 22.94,5.49 v22.89,5.44 | C432.1 24.77,25.4 25.76,24.41 25.76,18.57 25.98,18.34 C443.1 | 27.13,18.31 26.11,18.31 C443.1 | 27.13,18.31 28.42,18.31 U401.43 | 30.3,12.04 31.19,12.04 C451.1 31.27,12.12 31.27,13.95 U401.51 31.32,14.02 31.39,14.1 31.39,16.56 v31.57,16.74 | 30.3,12.04 30.12,12.04 26.42,8.33 U101.2 | 30.3,12.04 30.3,13.95 U401.49 | 37.34,15.01 37.29,15.01 U401.63 | 37.34,15.01 38.02,15.01 38.18,14.86 38.18,14.05 C463.1 | U401.3 39.62,16.82 38.58,16.82 38.58,18.54 38.81,18.77 39.57,18.77 U401.7 39.65,18.8 40.44,18.8 40.79,18.44 C407.1 41.71,18.49 v42.49,19.28 | v37.34,19.23 37.34,15.01 | v34.8,19.86 34.8,25.09 U401.23 34.8,27.05 34.92,27.18 C423.1 34.87,27.23 34.87,29.79 C1.1 34.54,30.85 34.54,35.69 U600.1 | v27.13,18.26 27.13,18.31
  Bottom 0.152: v46.08,20.07 45.29,19.28 v42.49,19.28 42.44,19.23 v37.34,19.23 37.29,19.18 35.53,19.18 | v8.81,9.25 v13.31,4.75 v17.32,4.75 18.01,5.44 v22.89,5.44 | JP5.4 50.7,2.44 50.7,9.04 44.86,9.04 35.53,18.36 | 35.53,19.18 35.53,18.36 | 35.53,18.36 35.48,18.31 33.15,18.31 v31.57,16.74 30.4,17.91 27.48,17.91 v27.13,18.26 | v34.8,19.86 35.43,19.23 35.48,19.23 35.53,19.18
VIN  (via drill 0.33)
  Top 0.152: C501.1 arc-90 54.24,24.64 53.05,24.64 U501.1 52.86,24.38 51.56,24.38 | 51.56,25.3 51.56,26.35 U501.3 | 51.56,25.3 51.56,24.38 | 51.56,24.38 51.56,20.64 U201.1 53.05,20.83 54.24,20.83 arc90 C201.1 54.36,18.37 D302.3 | 53.77,17.78 D302.3 | 53.7,17.75 D302.3 | D302.3 52.58,17.78 51.56,16.76 v51.56,16.51 | v51.51,25.3 51.56,25.3 | v20.4,26.14 20.4,30.1 10.64,30.1 10.52,29.97 10.52,29.77 U502.11 | v50.85,15.16 50.85,13.95 U$4.6
  Bottom 0.152: v20.4,26.14 50.67,26.14 v51.51,25.3 | v50.85,15.16 51.56,15.88 v51.56,16.51
VLIPO  (via drill 0.33)
  Top 0.152: C301.1 48.88,17.02 50.07,17.02 arc-90 U301.3 50.32,16.92 50.29,16.92 50.29,17.02 51.18,17.02 51.18,17.78 v51.56,17.78 | D302.2 54.86,18.73 v54.86,17.78 | v53.95,10.16 J301.2
  Bottom 0.152: v54.86,17.78 53.95,17.78 | 53.95,17.78 v51.56,17.78 | v53.95,10.16 53.95,17.78
XTAL1
  Top 0.152: C462.2 37.41,12.09 Y401.3 36.96,12.7 36.83,12.7 36.79,12.74 U401.62
XTAL2
  Top 0.152: C461.2 35.23,10.77 Y401.1 35.26,10.62 36.32,11.68 36.32,13.92 U401.61

### Text on the board
tPlace: PWM2 | 01 Jul 2014 | GPS | PWM5 | CAMERA | P | + | - | GRN | CHARGE | ON | BSL | RESET | Project Yukari 3.0
bPlace: St Kwan's Home for | the Terminally ADD | a division of Kwan Systems | stkwans.blogspot.com
Document: Released under the Creative Commons Attribution Share-Alike 3.0 License | http://creativecommons.org/licenses/by-sa/3.0 | Original design by C. Taylor and N. Seidle, Sparkfun Electronics http://www.sparkfun.com/products/10216 | Heavily modified by C. Jeppesen, St Kwan's Home for the Terminally ADD, stkwans.blogspot.com